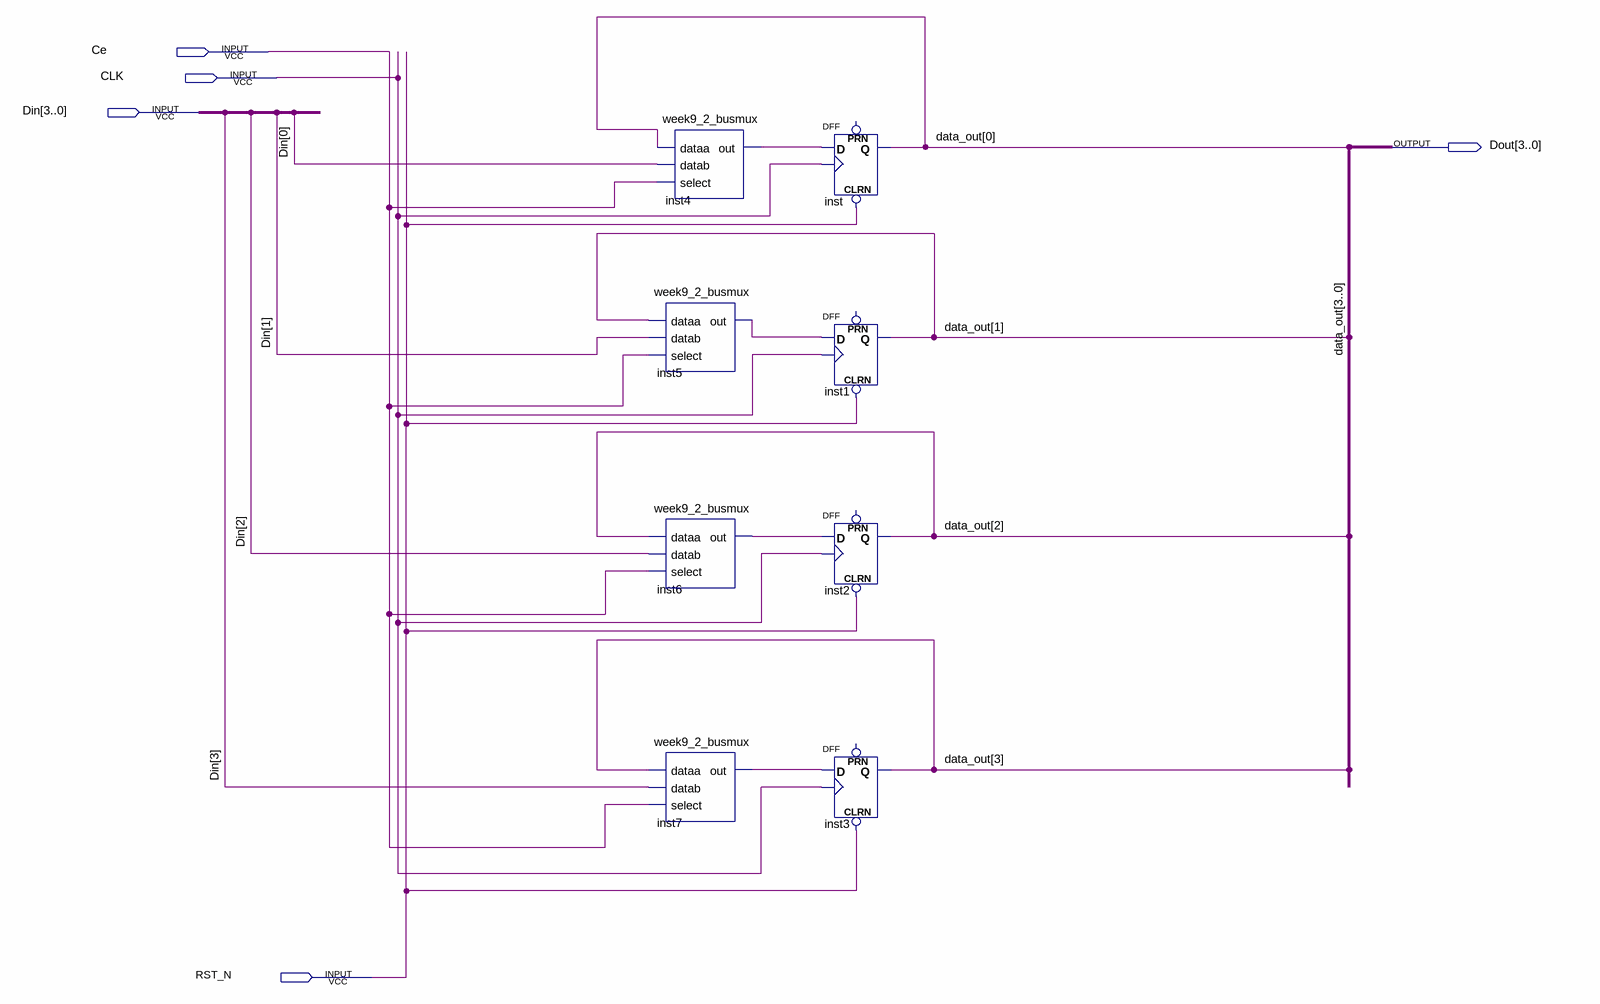
[diagram p0: schematic sheet]
// Quartus schematic four_bit_register.bdf as structural Verilog: 8 symbols, 5 pins
module four_bit_register (
  input  Ce,
  input  CLK,
  input  [3:0] Din,
  input  RST_N,
  output [3:0] Dout
);

  wire inst4_out, inst5_out, inst6_out, inst7_out;

  week9_2_busmux inst4 (.dataa(Dout[0]), .datab(Din[0]), .select(Ce), .out(inst4_out));
  week9_2_busmux inst5 (.dataa(Dout[1]), .datab(Din[1]), .select(Ce), .out(inst5_out));
  week9_2_busmux inst6 (.dataa(Dout[2]), .datab(Din[2]), .select(Ce), .out(inst6_out));
  week9_2_busmux inst7 (.dataa(Dout[3]), .datab(Din[3]), .select(Ce), .out(inst7_out));
  DFF inst (.CLRN(RST_N), .CLK(CLK), .D(inst4_out), .Q(Dout[0]));  // open: PRN
  DFF inst1 (.CLRN(RST_N), .CLK(CLK), .D(inst5_out), .Q(Dout[1]));  // open: PRN
  DFF inst2 (.CLRN(RST_N), .CLK(CLK), .D(inst6_out), .Q(Dout[2]));  // open: PRN
  DFF inst3 (.CLRN(RST_N), .CLK(CLK), .D(inst7_out), .Q(Dout[3]));  // open: PRN

  // Other names for the same wires on the sheet: data_out[3:0] = Dout
endmodule
